# Altium schematic sheet Power.SchDoc: PSDK&RFID_Ver_02
size A4; Date: 2021年6月15日
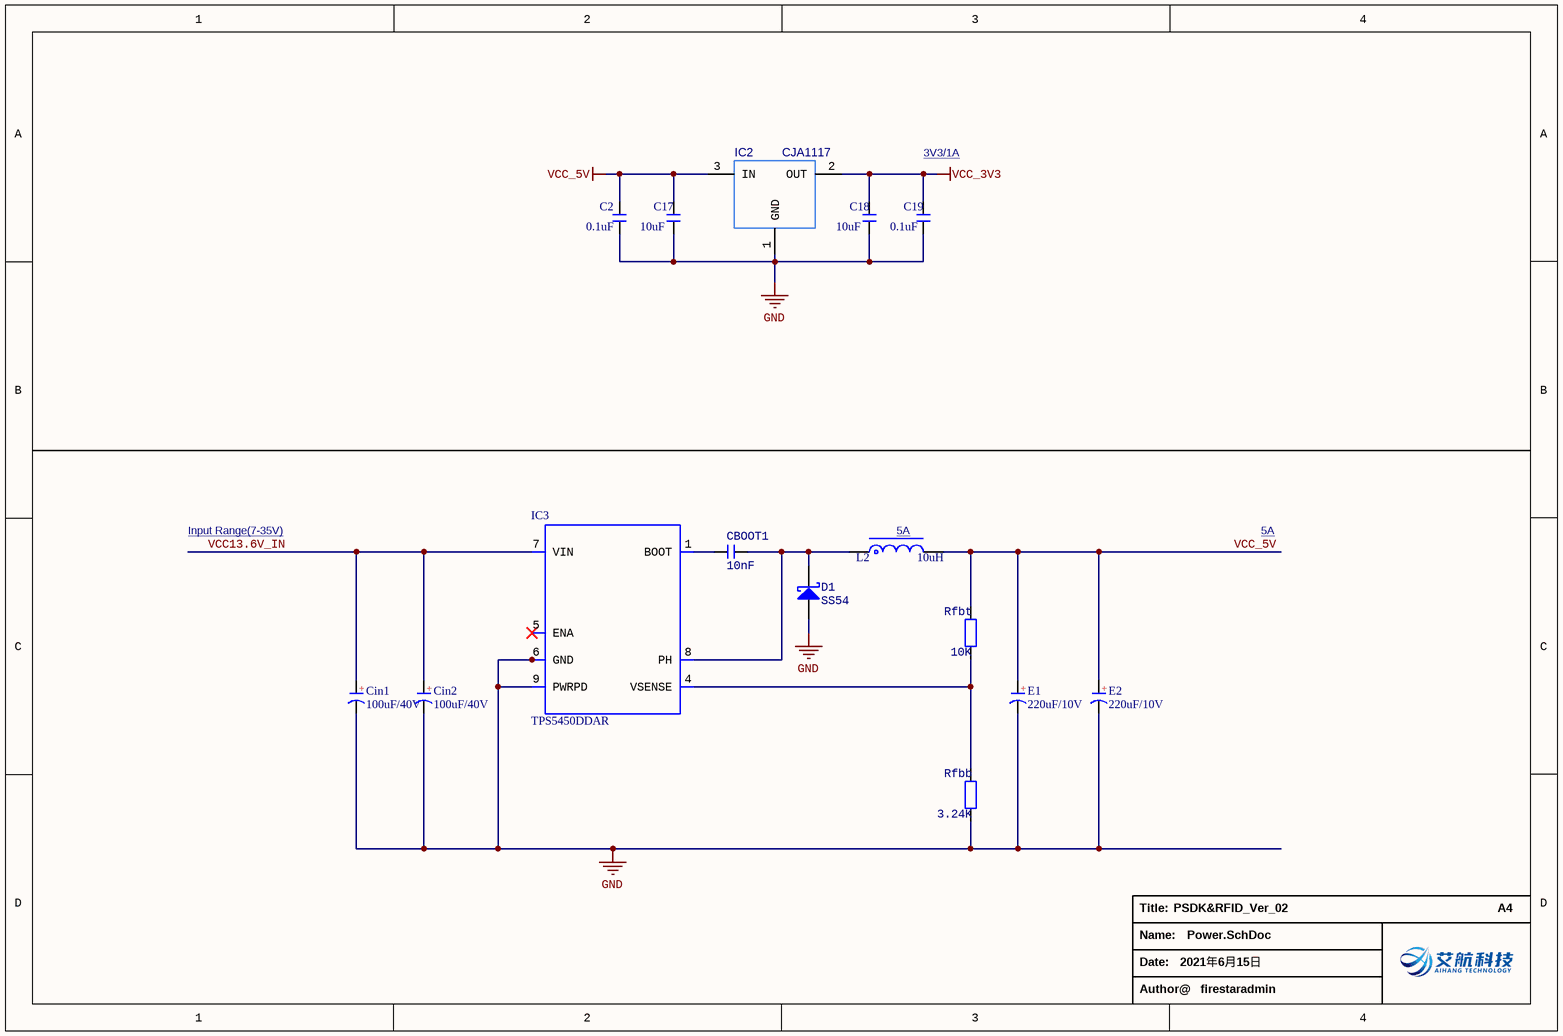
[diagram p0: Power.SchDoc]

## Parts
C2  0.1uF  [C 0603_L]
C17  10uF  [C 0805_L]
C18  10uF  [C 0805_L]
C19  0.1uF  [C 0603_L]
CBOOT1  10nF  [C 0603_L]
Cin1  100uF/40V  [CM D(6.3*7.7)]
Cin2  100uF/40V  [CM D(6.3*7.7)]
D1  SS54  [SMC]
E1  220uF/10V  [CD D(7343)]
E2  220uF/10V  [CD D(7343)]
IC2  CJA1117  [SOT89_M]
IC3  PackageReference: TPS5450DDAR  [ESOP8_N]  (hidden comment: TPS5450)
L2  10uH  [L-SMD-1040]
Rfbb  3.24K  [R 0603_L]
Rfbt  10K  [R 0603_L]

## Nets
GND: C2.1 C17.1 C18.1 C19.1 Cin1.2(K) Cin2.2(K) D1.1(A) E1.2(K) E2.2(K) IC2.1(GND) IC3.2(NC) IC3.3(NC) IC3.6(GND) IC3.9(PWRPD) Rfbb.1
VCC_3V3: C18.2 C19.2 IC2.2(OUT)
VCC_5V: C2.2 C17.2 E1.1(A) E2.1(A) IC2.3(IN) L2.2 Rfbt.2
VCC13.6V_IN: Cin1.1(A) Cin2.1(A) IC3.7(VIN)
NetCBOOT1_1: CBOOT1.1 IC3.1(BOOT)
NetCBOOT1_2: CBOOT1.2 D1.2(K) IC3.8(PH) L2.1
NetIC3_4: IC3.4(VSENSE) Rfbb.2 Rfbt.1

Not connected (* = marked no-connect by the designer): IC3 5(ENA)*

## Notes on the sheet
- 3V3/1A
- Input Range(7-35V)
- (near L2) 5A
- 5A
- Title:
- A4
- Name:
- Date:
- Author@
- firestaradmin
- (in symbol C-CD) +
- (in symbol C-CM) +

## Library data of the parts
C2 C17-C19 CBOOT1 = C: 无极性贴片电容; 版权归属: 源创客; BOM名称: 无极性贴片电容; 学习资源: www.ooocke.com
Cin1 Cin2 = C-CM: 贴片电解电容; 版权归属: 源创客; BOM名称: 贴片电解电容; 学习资源: www.ooocke.com
D1 = SS54: 肖特基二极管
E1 E2 = C-CD: 贴片钽电容; 版权归属: 源创客; BOM名称: 贴片钽电容; 学习资源: www.ooocke.com
IC2 = CJA1117: 线性稳压器(LDO) SOT89  CJA1117B-3.3 : 最大输入电压  15V ; 3.3V @ 1A
IC3 = TPS5450: DC-Buck芯片 | TPS5450DDAR| 5A | 500KHz | Input Voltage Range: 5.5 V to 36 V | / Up to 5-A Continuous (6-A Peak) Output Current | Efficiency Greater Than 90%; Manufacturer Name: Texas Instruments; Manufacturer Part Number: TPS5450DDA; Value: N/A
L2 = L-CD: 贴片功率电感; BOM名称: 功率电感; 版权归属: 源创客; 学习资源: www.ooocke.com
Rfbb Rfbt = R: 贴片电阻; 版权归属: 源创客; BOM名称: 贴片电阻; 学习资源: www.ooocke.com